# EAGLE design V1 (EAGLE 9.6.2)
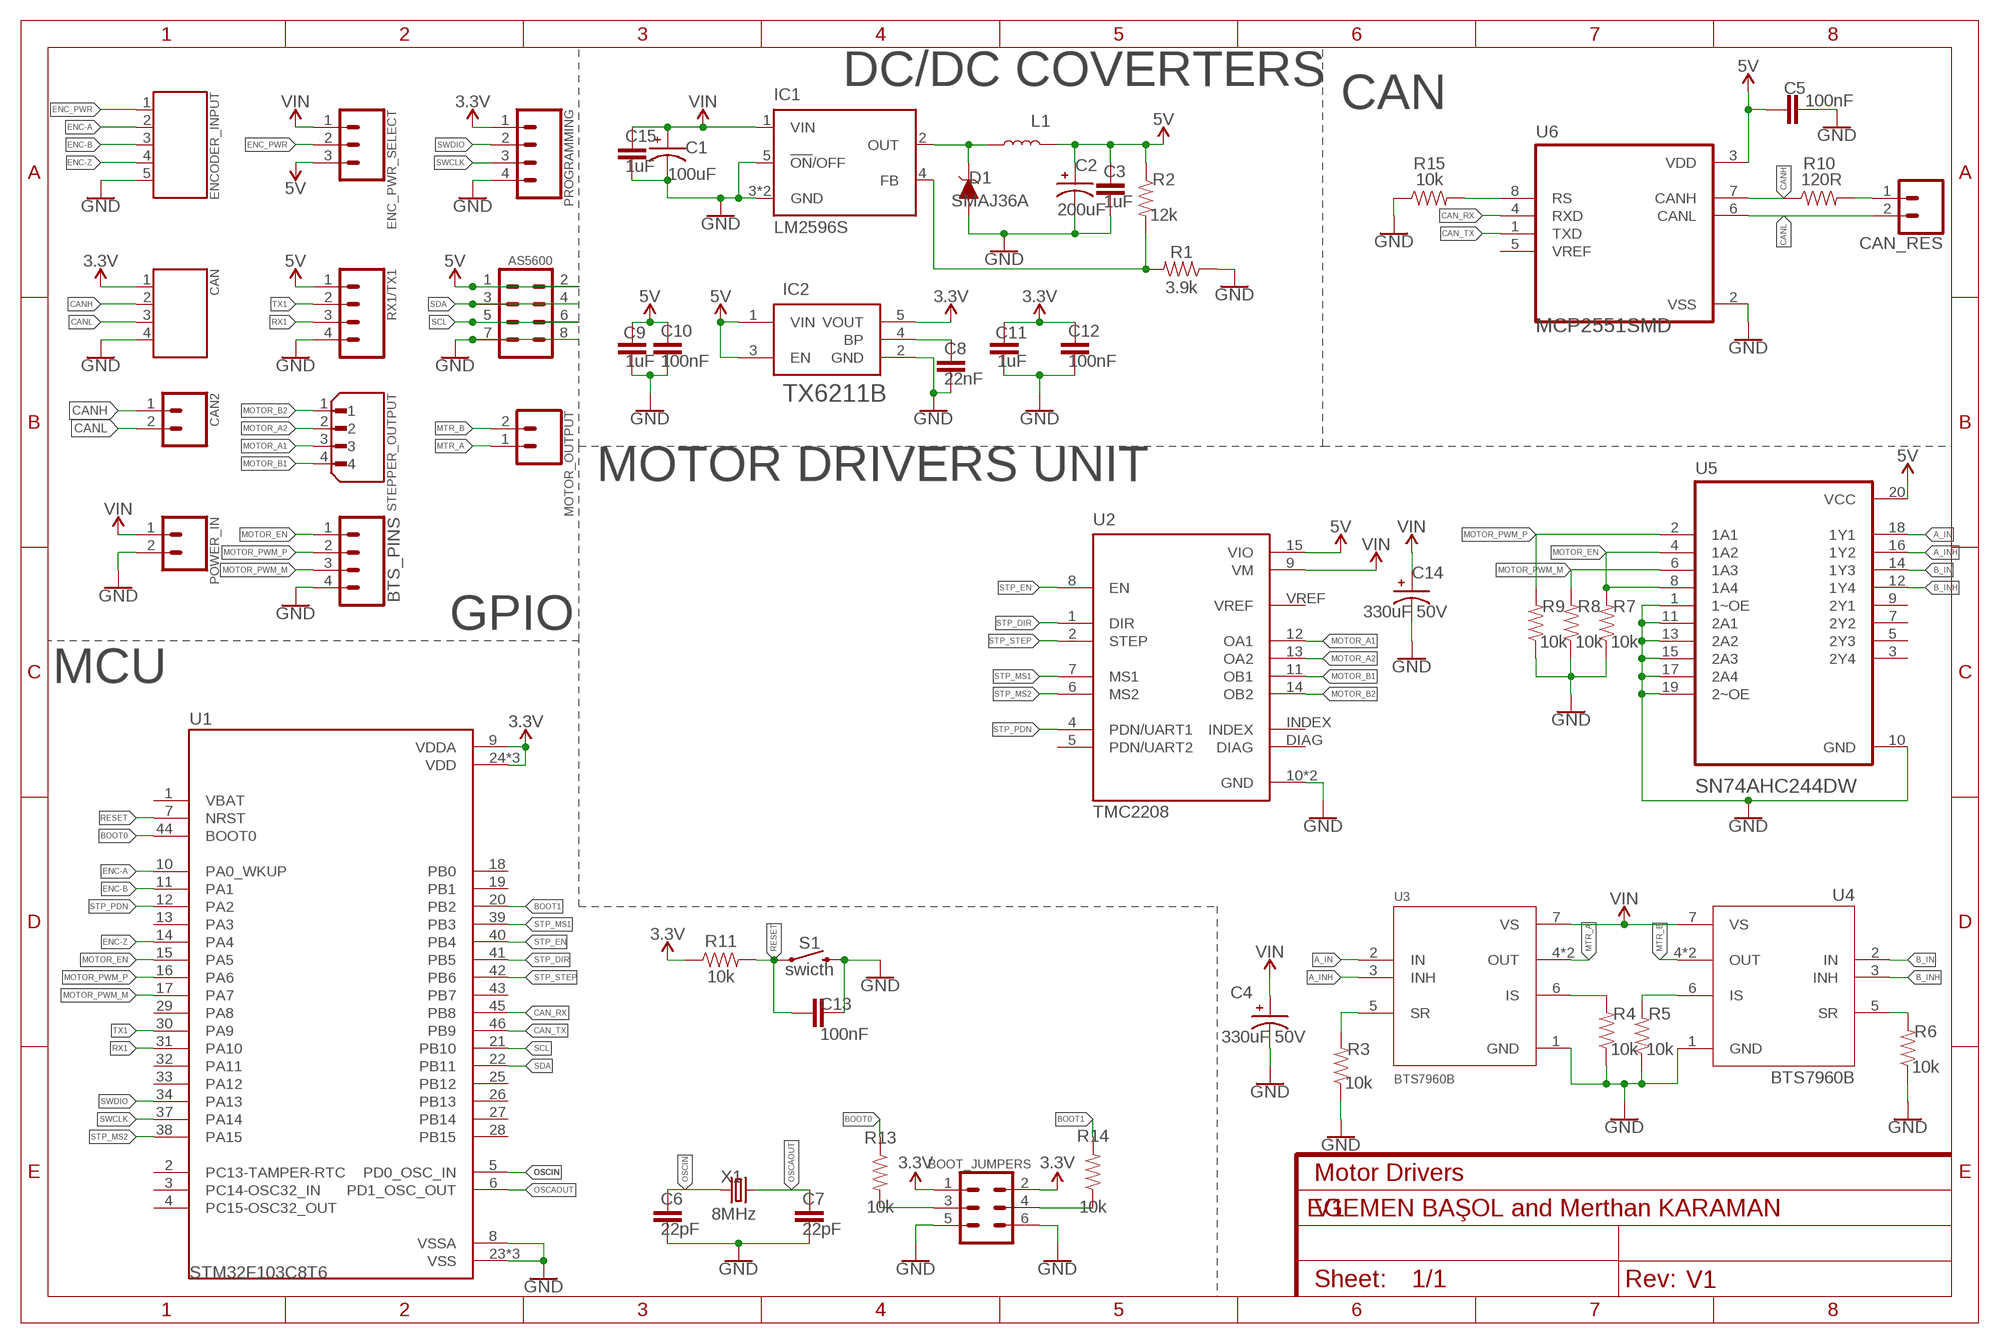
[diagram p0: schematic, sheet 1]
FRAME1 (FRAME-A4L): CNAME: Motor Drivers; CREVISION: V1; DESIGNER: EGEMEN BAŞOL and Merthan KARAMAN; REV: V1

## Parts
AS5600  5V/SDA/SCL/GND  CONN_04X2  [2X4]
BOOT_JUMPERS  CONN_03X2FEMALE  [2X3]
BTS_PINS  GND/ PWM_M/ PWM_P/ EN  CONN_04  [1X04]
C1  100uF  CPOL-SMD  [CPOL-SMD]
C2  200uF  CPOL-SMD  [CPOL-SMD]
C3  1uF  0.18UF-0603-10V-10%  [0603]
C4  330uF 50V  CPOL-RADIAL-5MM-10MM  [CPOL-RADIAL-5MM-10MM]
C5  100nF  CAP-0805  [0805]
C6  22pF  2.2UF-0805-25V-(+80/-20%)  [0805]
C7  22pF  2.2UF-0805-25V-(+80/-20%)  [0805]
C8  22nF  2.2UF-0805-25V-(+80/-20%)  [0805]
C9  1uF  CAP-0805  [0805]
C10  100nF  2.2UF-0805-25V-(+80/-20%)  [0805]
C11  1uF  CAP-0805  [0805]
C12  100nF  2.2UF-0805-25V-(+80/-20%)  [0805]
C13  100nF  2.2UF-0805-25V-(+80/-20%)  [0805]
C14  330uF 50V  CPOL-RADIAL-5MM-10MM  [CPOL-RADIAL-5MM-10MM]
C15  1uF  2.2UF-0805-25V-(+80/-20%)  [0805]
CAN  3.3V/CANH/CANL/GND  5.08MM_4PIN  [5.08MM_4PIN]
CAN2  CANH/CANL  5.08MM_2PIN  [5.08MM_2PIN]
CAN_RES  CONN_02  [1X02]
D1  SMAJ36A  DIODE_TVS_UNI  [DO-214AC]
ENC_PWR_SELECT  VIN/PWR/5V  CONN_03  [1X03]
ENCODER_INPUT  PWR/A/B/Z/GND  5.08MM_5PIN  [5.08MM_5PIN]
IC1  LM2596S  [TO263-5]
IC2  TX6211B  [SOT23-5]
L1  47uH  COIL  [COIL_14X14]
MOTOR_OUTPUT  5.08MM_2PIN  [5.08MM_2PIN]
POWER_IN  VIN/GND  5.08MM_2PIN  [5.08MM_2PIN]
PROGRAMMING  3.3V/SWDIO/SWCLK/GND  CONN_04  [1X04]
R1  3.9k  RESISTOR0805  [0805]
R2  12k  RESISTOR0805  [0805]
R3  10k  RESISTOR0805  [0805]
R4  10k  RESISTOR0805  [0805]
R5  10k  RESISTOR0805  [0805]
R6  10k  RESISTOR0805  [0805]
R7  10k  RESISTOR0805  [0805]
R8  10k  RESISTOR0805  [0805]
R9  10k  RESISTOR0805  [0805]
R10  120R  RESISTOR0805  [0805]
R11  10k  RESISTOR0805  [0805]
R13  10k  RESISTOR0805  [0805]
R14  10k  RESISTOR0805  [0805]
R15  10k  RESISTOR0805  [0805]
RX1/TX1  5V/TX1/RX1/GND  CONN_04  [1X04]
S1  swicth  MOMENTARY-SWITCH-SPST-SMD-5.2MM-TALL  [TACTILE_SWITCH_SMD_5.2MM]
STEPPER_OUTPUT  4PIN_TUNIC_2.5MM  [JST_B4B-XH-A(LF)(SN)]
U1  STM32F103C8T6  [LQFP-48]
U2  TMC2208  TMC2208_SILENTSTEPSTICK  [MODULE_TMC2208_SILENTSTEPSTICK]
U3  BTS7960B  [DPAK127P1490X440-8N]
U4  BTS7960B  [DPAK127P1490X440-8N]
U5  SN74AHC244DW  [SOIC127P1030X265-20N]
U6  MCP2551SMD  [SOIC-8]
X1  8MHz  CRYSTALS-NOGND-HC49  [HC49]

## Nets
3.3V: BOOT_JUMPERS.1 BOOT_JUMPERS.2 C11.2 C12.2 CAN.1 IC2.5(VOUT) PROGRAMMING.1 R11.1 U1.9(VDDA) U1.24(VDD) U1.36(VDD) U1.48(VDD)
5V: AS5600.1 AS5600.2 C2.1 C3.2 C5.2 C9.2 C10.2 ENC_PWR_SELECT.3 IC2.1(VIN) IC2.3(EN) L1.P$2 R2.1 RX1/TX1.1 U2.15(VIO) U5.20(VCC) U6.3(VDD)
A_IN: U3.2(IN) U5.18(1Y1)
A_INH: U3.3(INH) U5.16(1Y2)
B_IN: U4.2(IN) U5.14(1Y3)
B_INH: U4.3(INH) U5.12(1Y4)
BOOT0: R13.1 U1.44(BOOT0)
BOOT1: R14.2 U1.20(PB2)
CAN_RX: U1.45(PB8) U6.4(RXD)
CAN_TX: U1.46(PB9) U6.1(TXD)
CANH: CAN2.1 CAN.2 R10.1 U6.7(CANH)
CANL: CAN2.2 CAN.3 CAN_RES.2 U6.6(CANL)
ENC-A: ENCODER_INPUT.2 U1.10(PA0_WKUP)
ENC-B: ENCODER_INPUT.3 U1.11(PA1)
ENC-Z: ENCODER_INPUT.4 U1.14(PA4)
ENC_PWR: ENC_PWR_SELECT.2 ENCODER_INPUT.1
GND: AS5600.7 AS5600.8 BOOT_JUMPERS.5 BOOT_JUMPERS.6 BTS_PINS.4 C1.2 C2.2 C3.1 C4.N C5.1 C6.1 C7.1 C8.1 C9.1 C10.1 C11.1 C12.1 C13.1 C14.N C15.1 CAN.4 D1.A ENCODER_INPUT.5 IC1.3(GND) IC1.5(!ON!/OFF) IC1.TAB(GND) IC2.2(GND) POWER_IN.2 PROGRAMMING.4 R1.1 R3.1 R4.1 R5.1 R6.1 R7.1 R8.1 R9.1 R15.1 RX1/TX1.4 S1.3 U1.8(VSSA) U1.23(VSS) U1.35(VSS) U1.47(VSS) U2.10(GND) U2.16(GND) U3.1(GND) U4.1(GND) U5.1(1~OE) U5.10(GND) U5.11(2A1) U5.13(2A2) U5.15(2A3) U5.17(2A4) U5.19(2~OE) U6.2(VSS)
MOTOR_A1: STEPPER_OUTPUT.3 U2.12(OA1)
MOTOR_A2: STEPPER_OUTPUT.2 U2.13(OA2)
MOTOR_B1: STEPPER_OUTPUT.4 U2.11(OB1)
MOTOR_B2: STEPPER_OUTPUT.1 U2.14(OB2)
MOTOR_EN: BTS_PINS.1 R7.2 U1.15(PA5) U5.4(1A2) U5.8(1A4)
MOTOR_PWM_M: BTS_PINS.3 R8.2 U1.17(PA7) U5.6(1A3)
MOTOR_PWM_P: BTS_PINS.2 R9.2 U1.16(PA6) U5.2(1A1)
MTR_A: MOTOR_OUTPUT.1 U3.4(OUT) U3.8(OUT)
MTR_B: MOTOR_OUTPUT.2 U4.4(OUT) U4.8(OUT)
N$1: D1.C IC1.2(OUT) L1.P$1
N$2: IC1.4(FB) R1.2 R2.2
N$5: CAN_RES.1 R10.2
N$6: R6.2 U4.5(SR)
N$7: R5.2 U4.6(IS)
N$8: R4.2 U3.6(IS)
N$9: R3.2 U3.5(SR)
N$10: C8.2 IC2.4(BP)
N$12: BOOT_JUMPERS.4 R14.1
N$13: R15.2 U6.8(RS)
N$14: BOOT_JUMPERS.3 R13.2
OSCAOUT: C7.2 U1.6(PD1_OSC_OUT) X1.2
OSCIN: C6.2 U1.5(PD0_OSC_IN) X1.1
RESET: C13.2 R11.2 S1.1 U1.7(NRST)
RX1: RX1/TX1.3 U1.31(PA10)
SCL: AS5600.5 AS5600.6 U1.21(PB10)
SDA: AS5600.3 AS5600.4 U1.22(PB11)
STP_DIR: U1.41(PB5) U2.1(DIR)
STP_EN: U1.40(PB4) U2.8(EN)
STP_MS1: U1.39(PB3) U2.7(MS1)
STP_MS2: U1.38(PA15) U2.6(MS2)
STP_PDN: U1.12(PA2) U2.4(PDN/UART1)
STP_STEP: U1.42(PB6) U2.2(STEP)
SWCLK: PROGRAMMING.3 U1.37(PA14)
SWDIO: PROGRAMMING.2 U1.34(PA13)
TX1: RX1/TX1.2 U1.30(PA9)
VIN: C1.1 C4.P C14.P C15.2 ENC_PWR_SELECT.1 IC1.1(VIN) POWER_IN.1 U2.9(VM) U3.7(VS) U4.7(VS)
Unconnected: U1.1(VBAT) U1.2(PC13-TAMPER-RTC) U1.3(PC14-OSC32_IN) U1.4(PC15-OSC32_OUT) U1.13(PA3) U1.18(PB0) U1.19(PB1) U1.25(PB12) U1.26(PB13) U1.27(PB14) U1.28(PB15) U1.29(PA8) U1.32(PA11) U1.33(PA12) U1.43(PB7) U2.5(PDN/UART2) U2.DIAG U2.INDEX U2.VREF U5.3(2Y4) U5.5(2Y3) U5.7(2Y2) U5.9(2Y1) U6.5(VREF)

## Notes on the sheet
- DC/DC COVERTERS
- CAN
- MOTOR DRIVERS UNIT
- GPIO
- MCU

## Library data of the parts
AS5600 = SparkFun-Connectors:CONN_04X2: Multi connection point. Often used as Generic Header-pin footprint for 0.1 inch spaced/style header connections On any of the 0.1 inch spaced packages, you can populate with these: Break Away Headers - Straight <https://www.sparkfun.com/products/116> (PRT-00116) Break Away Male Headers - Right Angle <https://www.sparkfun.com/products/553> (PRT-00553) Female Headers <https://www.sparkfun.com/products/115> (PRT-00115) Break Away Headers - Machine Pin <https://www.sparkfun.com/products/117> (PRT-00117) Break Away Female Headers - Swiss Machine Pin <https://www.sparkfun.com/products/743> (PRT-00743)
BOOT_JUMPERS = SparkFun-Connectors:CONN_03X2: Multi connection point. Often used as Generic Header-pin footprint for 0.1 inch spaced/style header connections You can populate with any combo of single row headers, but if you'd like an exact match, check these: Header - 2x3 (Male, 0.1") <https://www.sparkfun.com/products/12807> (PRT-12807) Header - 2x3 (Female, 0.1") <https://www.sparkfun.com/products/13010> (PRT-13010) 2x3 Pin Shrouded Header <https://www.sparkfun.com/products/10877> (PRT-10877) On any of the 0.1 inch spaced packages, you can populate with these: Break Away Headers - Straight <https://www.sparkfun.com/products/116> (PRT-00116) Break Away Male Headers - Right Angle <https://www.sparkfun.com/products/553> (PRT-00553) Female Headers <https://www.sparkfun.com/products/115> (PRT-00115) Break Away Headers - Machine Pin <https://www.sparkfun.com/products/117> (PRT-00117) Break Away Female Headers - Swiss Machine Pin <https://www.sparkfun.com/products/743> (PRT-00743) Special note: the shrouded connector mates well with our 3x2 ribbon cables: Ribbon Crimp Connector - 6-pin (2x3, Female) <https://www.sparkfun.com/products/10651> (PRT-10651) Ribbon Cable - 6 wire (15ft) <https://www.sparkfun.com/products/10646> (PRT-10646); PROD_ID: CONN-11566; VALUE: FEMALE 2x3
BTS_PINS PROGRAMMING RX1/TX1 = SparkFun-Connectors:CONN_04: Multi connection point. Often used as Generic Header-pin footprint for 0.1 inch spaced/style header connections On any of the 0.1 inch spaced packages, you can populate with these: Break Away Headers - Straight <https://www.sparkfun.com/products/116> (PRT-00116) Break Away Male Headers - Right Angle <https://www.sparkfun.com/products/553> (PRT-00553) Female Headers <https://www.sparkfun.com/products/115> (PRT-00115) Break Away Headers - Machine Pin <https://www.sparkfun.com/products/117> (PRT-00117) Break Away Female Headers - Swiss Machine Pin <https://www.sparkfun.com/products/743> (PRT-00743) For SCREWTERMINALS and SPRING TERMINALS visit here: Screw Terimnals on SparkFun.com <https://www.sparkfun.com/search/results?term=Screw+Terminals> (5mm/3.5mm/2.54mm spacing) This device is also useful as a general connection point to wire up your design to another part of your project. Our various solder wires solder well into these plated through hole pads. Hook-Up Wire - Assortment (Stranded, 22 AWG) <https://www.sparkfun.com/products/11375> (PRT-11375) Hook-Up Wire - Assortment (Solid Core, 22 AWG) <https://www.sparkfun.com/products/11367> (PRT-11367) View the entire wire category on our website here <https://www.sparkfun.com/categories/141> Special notes: Molex polarized connector foot print use with SKU : PRT-08231 with associated crimp pins and housings. 1MM SMD Version SKU: PRT-10208; PROD_ID: CONN-09696
C1 C2 = El_yapimi:CPOL-SMD: Check availability <https://pricing.snapeda.com/parts/EEEFN1H101L/Panasonic/view-part?ref=eda>; AVAILABILITY: In Stock; DESCRIPTION: CAP ALUM 100UF 20% 50V SMD; MF: Panasonic; MP: EEEFN1H101L; PACKAGE: RADIAL-2 Panasonic; PRICE: None; PURCHASE-URL: https://pricing.snapeda.com/search/part/EEEFN1H101L/?ref=eda
C3 = SparkFun-Capacitors:0.18UF: 0.18µF ceramic capacitor A capacitor is a passive two-terminal electrical component used to store electrical energy temporarily in an electric field.; PROD_ID: CAP-12380; VALUE: 0.18uF
C4 C14 = El_yapimi:CPOL-RADIAL-5MM-10MM: M-A Check availability <https://pricing.snapeda.com/parts/ECA2VM4R7/Panasonic/view-part?ref=eda>; AVAILABILITY: In Stock; DESCRIPTION: Aluminium Electrolytic Capacitor, Aec-Q200 M Series, 4.7 - F, - 20%, 350 V, 10 Mm; MF: Panasonic; MP: ECA2VM4R7; PACKAGE: RADIAL-2 Panasonic; PRICE: None; PURCHASE-URL: https://pricing.snapeda.com/search/part/ECA2VM4R7/?ref=eda
C5 C9 C11 = SparkFun-Capacitors:CAP
C6-C8 C10 C12 C13 C15 = SparkFun-Capacitors:2.2UF: 2.2µF ceramic capacitors A capacitor is a passive two-terminal electrical component used to store electrical energy temporarily in an electric field.; PROD_ID: CAP-11624; VALUE: 2.2uF
CAN = El_yapimi:5.08MM_4PIN: Check availability <https://pricing.snapeda.com/parts/TB006-508-04BE/CUI%20Devices/view-part?ref=eda>; AVAILABILITY: In Stock; CUI_PURCHASE_URL: https://www.cuidevices.com/product/interconnect/connectors/terminal-blocks/tb006-508-series?utm_source=snapeda.com&utm_medium=referral&utm_campaign=snapedaBOM; DESCRIPTION: 2~24 Poles, Screw Type, Horizontal, 5.08 Pitch, 26~14 (AWG), Terminal Block Connector; MF: CUI Devices; MP: TB006-508-04BE; PACKAGE: None; PRICE: None; PURCHASE-URL: https://pricing.snapeda.com/search/part/TB006-508-04BE/?ref=eda
CAN2 MOTOR_OUTPUT POWER_IN = El_yapimi:5.08MM_2PIN
CAN_RES = SparkFun-Connectors:CONN_02: Multi connection point. Often used as Generic Header-pin footprint for 0.1 inch spaced/style header connections On any of the 0.1 inch spaced packages, you can populate with these: Break Away Headers - Straight <https://www.sparkfun.com/products/116> (PRT-00116) Break Away Male Headers - Right Angle <https://www.sparkfun.com/products/553> (PRT-00553) Female Headers <https://www.sparkfun.com/products/115> (PRT-00115) Break Away Headers - Machine Pin <https://www.sparkfun.com/products/117> (PRT-00117) Break Away Female Headers - Swiss Machine Pin <https://www.sparkfun.com/products/743> (PRT-00743) For SCREWTERMINALS and SPRING TERMINALS visit here: Screw Terimnals on SparkFun.com <https://www.sparkfun.com/search/results?term=Screw+Terminals> (5mm/3.5mm/2.54mm spacing) This device is also useful as a general connection point to wire up your design to another part of your project. Our various solder wires solder well into these plated through hole pads. Hook-Up Wire - Assortment (Stranded, 22 AWG) <https://www.sparkfun.com/products/11375> (PRT-11375) Hook-Up Wire - Assortment (Solid Core, 22 AWG) <https://www.sparkfun.com/products/11367> (PRT-11367) View the entire wire category on our website here <https://www.sparkfun.com/categories/141> Special notes: Molex polarized connector foot print use with: PRT-08233 with associated crimp pins and housings. 2.54_SCREWTERM for use with PRT-10571. 3.5mm Screw Terminal footprints for PRT-08084 5mm Screw Terminal footprints for use with PRT-08432
D1 = SparkFun-DiscreteSemi:DIODE_TVS_UNI; PROD_ID: DIO-15812
ENC_PWR_SELECT = SparkFun-Connectors:CONN_03: Multi connection point. Often used as Generic Header-pin footprint for 0.1 inch spaced/style header connections On any of the 0.1 inch spaced packages, you can populate with these: Break Away Headers - Straight <https://www.sparkfun.com/products/116> (PRT-00116) Break Away Male Headers - Right Angle <https://www.sparkfun.com/products/553> (PRT-00553) Female Headers <https://www.sparkfun.com/products/115> (PRT-00115) Break Away Headers - Machine Pin <https://www.sparkfun.com/products/117> (PRT-00117) Break Away Female Headers - Swiss Machine Pin <https://www.sparkfun.com/products/743> (PRT-00743) Stackable Header - 3 Pin (Female, 0.1") <https://www.sparkfun.com/products/13875> (PRT-13875) For SCREWTERMINALS and SPRING TERMINALS visit here: Screw Terimnals on SparkFun.com <https://www.sparkfun.com/search/results?term=Screw+Terminals> (5mm/3.5mm/2.54mm spacing) This device is also useful as a general connection point to wire up your design to another part of your project. Our various solder wires solder well into these plated through hole pads. Hook-Up Wire - Assortment (Stranded, 22 AWG) <https://www.sparkfun.com/products/11375> (PRT-11375) Hook-Up Wire - Assortment (Solid Core, 22 AWG) <https://www.sparkfun.com/products/11367> (PRT-11367) View the entire wire category on our website here <https://www.sparkfun.com/categories/141> Special notes: Molex polarized connector foot print use with SKU : PRT-08232 with associated crimp pins and housings.
ENCODER_INPUT = El_yapimi:5.08MM_5PIN: Check availability <https://pricing.snapeda.com/parts/TB006-508-05BE/CUI%20Devices/view-part?ref=eda>; AVAILABILITY: In Stock; CUI_PURCHASE_URL: https://www.cuidevices.com/product/interconnect/connectors/terminal-blocks/tb006-508-series?utm_source=snapeda.com&utm_medium=referral&utm_campaign=snapedaBOM; DESCRIPTION: 2~24 Poles, Screw Type, Horizontal, 5.08 Pitch, 26~14 (AWG), Terminal Block Connector; MF: CUI Devices; MP: TB006-508-05BE; PACKAGE: None; PRICE: None; PURCHASE-URL: https://pricing.snapeda.com/search/part/TB006-508-05BE/?ref=eda
IC1 = El_yapimi:LM2596S
IC2 = El_yapimi:TX6211B
L1 = El_yapimi:COIL
R1-R11 R13-R15 = SparkFun-Resistors:RESISTOR: Generic Resistor Package
S1 = SparkFun-Switches:MOMENTARY-SWITCH-SPST: Momentary Switch (Pushbutton) - SPST Normally-open (NO) SPST momentary switches (buttons, pushbuttons). Variants PTH-12MM - 12mm square, through-hole Momentary Pushbutton Switch - 12mm Square <https://www.sparkfun.com/products/9190> (COM-09190) PTH-6.0MM, PTH-6.0MM-KIT - 6.0mm square, through-hole Mini Pushbutton Switch <https://www.sparkfun.com/products/97> (COM-00097) KIT package intended for soldering kit's - only one side of pads' copper is exposed. PTH-RIGHT-ANGLE-KIT - Right-angle, through-hole Right Angle Tactile Button <https://www.sparkfun.com/products/10791> - Used on SparkFun BigTime Watch Kit <https://www.sparkfun.com/products/11734> SMD-12MM - 12mm square, surface-mount Tactile Button - SMD (12mm) <https://www.sparkfun.com/products/12993> (COM-12993) Used on SparkFun PicoBoard <https://www.sparkfun.com/products/11888> SMD-4.5MM - 4.5mm Square Trackball Switch Used on SparkFun Blackberry Trackballer Breakout <https://www.sparkfun.com/products/13169> SMD-4.6MMX2.8MM - 4.60mm x 2.80mm, surface mount Used on SparkFun Pro Micro - RP2040 <https://www.sparkfun.com/products/17717> SMD-5.2MM, SMD-5.2-REDUNDANT - 5.2mm square, surface-mount Mini Pushbutton Switch - SMD <https://www.sparkfun.com/products/8720> (COM-08720) Used on Arduino Pro Mini <https://www.sparkfun.com/products/11114> REDUNDANT package connects both switch circuits together SMD-6.0X3.5MM - 6.0 x 3.5mm, surface mount Momentary Reset Switch SMD <https://www.sparkfun.com/products/8229> (COM-08229) SMD-6.2MM-TALL - 6.2mm square, surface mount Tactile Button - SMD (6mm) <https://www.sparkfun.com/products/12992> Used on SparkFun Digital Sandbox <https://www.sparkfun.com/products/12651> SMD-RIGHT-ANGLE - Right-angle, surface mount Used on SparkFun Block for Intel® Edison - Arduino <https://www.sparkfun.com/products/13036>; PROD_ID: SWCH-14139
STEPPER_OUTPUT = El_yapimi:4PIN_TUNIC_2.5MM: Check availability <https://pricing.snapeda.com/parts/B4B-XH-A%28LF%29%28SN%29/JST%20Sales/view-part?ref=eda>; AVAILABILITY: In Stock; DESCRIPTION: Connector Header Through Hole 4 position 0.098 (2.50mm); MF: JST Sales; MP: B4B-XH-A(LF)(SN); PACKAGE: None; PRICE: None; PURCHASE-URL: https://pricing.snapeda.com/search/part/B4B-XH-A(LF)(SN)/?ref=eda
U1 = El_yapimi:STM32F103C8T6: Mainstream Performance line, ARM Cortex-M3 MCU with 64 Kbytes Flash, 72 MHz CPU, motor control, USB and CAN Check availability <https://pricing.snapeda.com/parts/STM32F103C8T6/STMicroelectronics/view-part?ref=eda>; AVAILABILITY: In Stock; DESCRIPTION: ARM® Cortex®-M3 STM32F1 Microcontroller IC 32-Bit 72MHz 64KB (64K x 8) FLASH 48-LQFP (7x7); MF: STMicroelectronics; MP: STM32F103C8T6; PACKAGE: LQFP-48 STMicroelectronics; PRICE: None; PURCHASE-URL: https://pricing.snapeda.com/search/part/STM32F103C8T6/?ref=eda
U2 = El_yapimi:TMC2208_SILENTSTEPSTICK: TMC2208 Motor Controller/Driver, Stepper Power Management Evaluation Board Check availability <https://pricing.snapeda.com/parts/TMC2208%20SILENTSTEPSTICK/Trinamic%20Motion/view-part?ref=eda>; AVAILABILITY: In Stock; DESCRIPTION: TMC2208 Motor Controller/Driver, Stepper Power Management Evaluation Board; MF: Trinamic Motion; MP: TMC2208 SILENTSTEPSTICK; PACKAGE: None; PRICE: None; PURCHASE-URL: https://pricing.snapeda.com/search/part/TMC2208 SILENTSTEPSTICK/?ref=eda
U3 U4 = El_yapimi:BTS7960B: Half Bridge Motor Driver 7-Pin(6+Tab) TO-263 Check availability <https://pricing.snapeda.com/parts/BTS7960B/Infineon/view-part?ref=eda>
U5 = El_yapimi:SN74AHC244DW: Check availability <https://pricing.snapeda.com/parts/SN74AHC244DW/Texas%20Instruments/view-part?ref=eda>; AVAILABILITY: In Stock; DESCRIPTION: 8-ch, 2-V to 5.5-V buffers with 3-state outputs; MF: Texas Instruments; MP: SN74AHC244DW; PACKAGE: SOIC-20 Texas Instruments; PRICE: None; PURCHASE-URL: https://pricing.snapeda.com/search/part/SN74AHC244DW/?ref=eda
U6 = El_yapimi:MCP2551: Check availability <https://pricing.snapeda.com/parts/MCP2551-E/P/Microchip/view-part?ref=eda>
X1 = IQD-Frequency-Products:CRYSTALS-NOGND: CRYSTALS CAN NOT GROUNDED

## Board
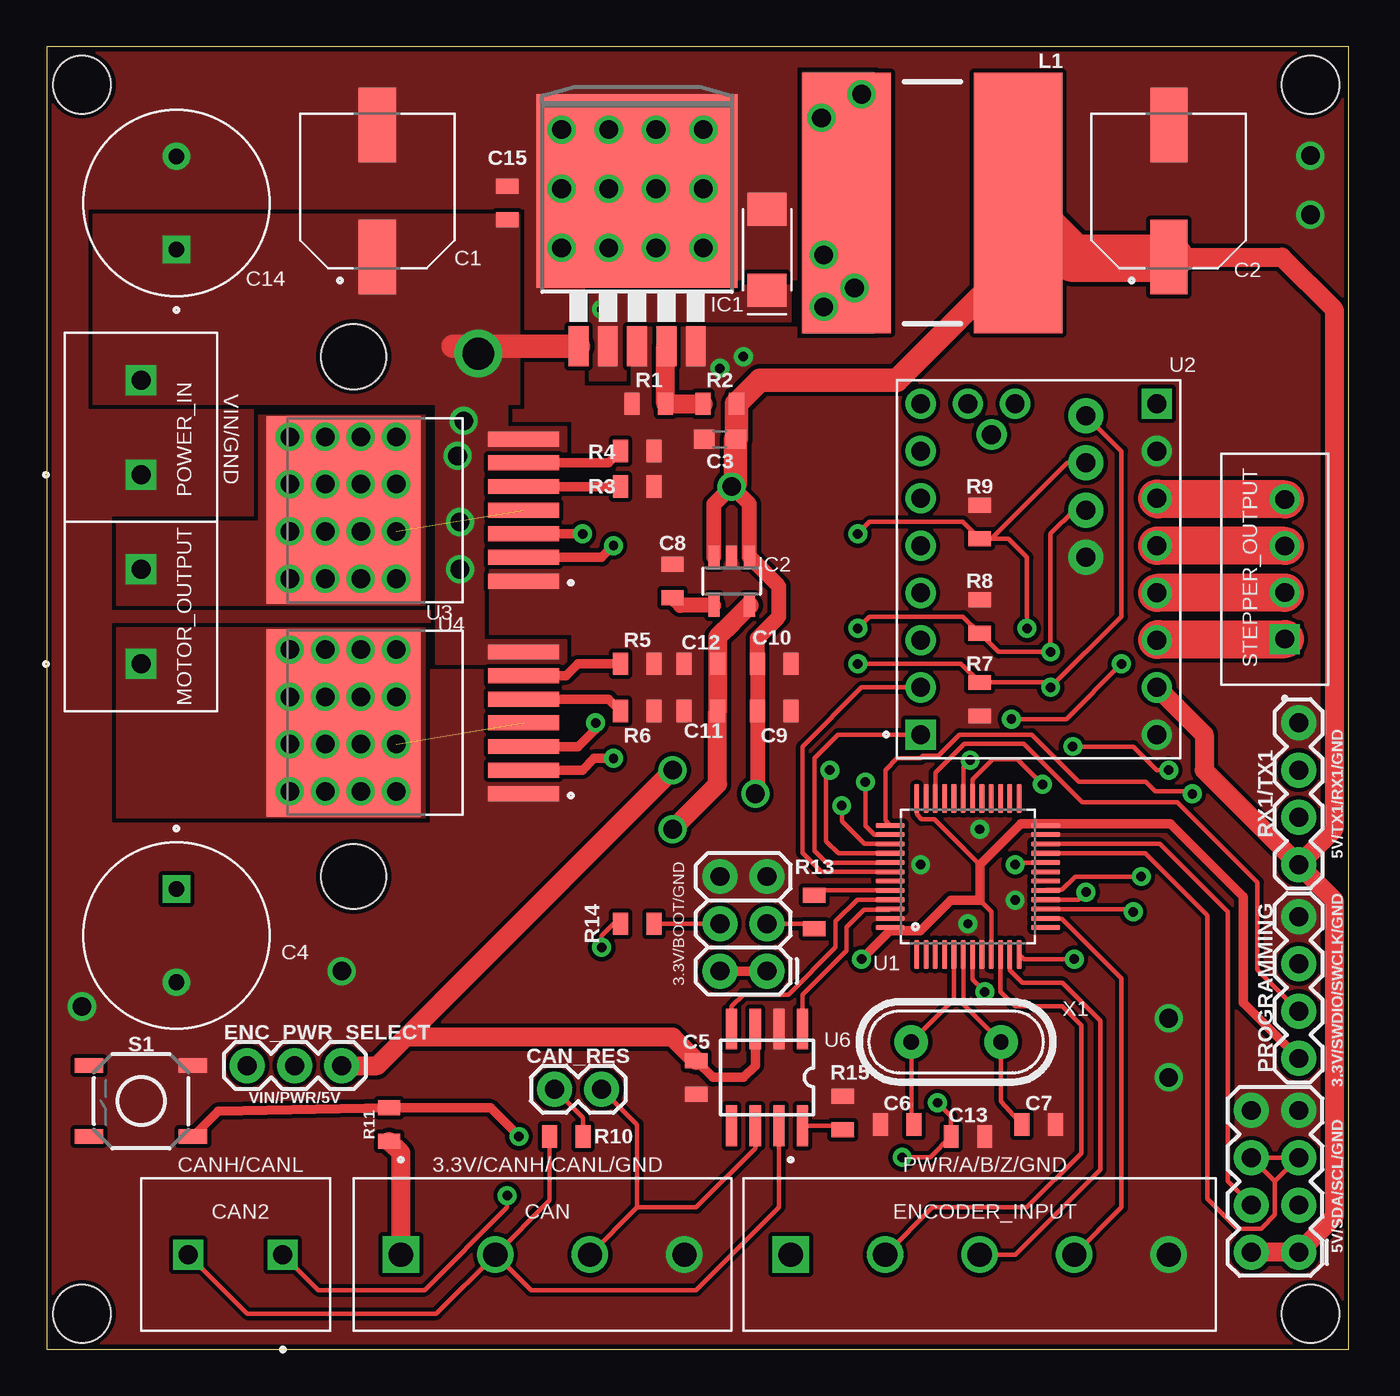
[diagram p1: board, top side]
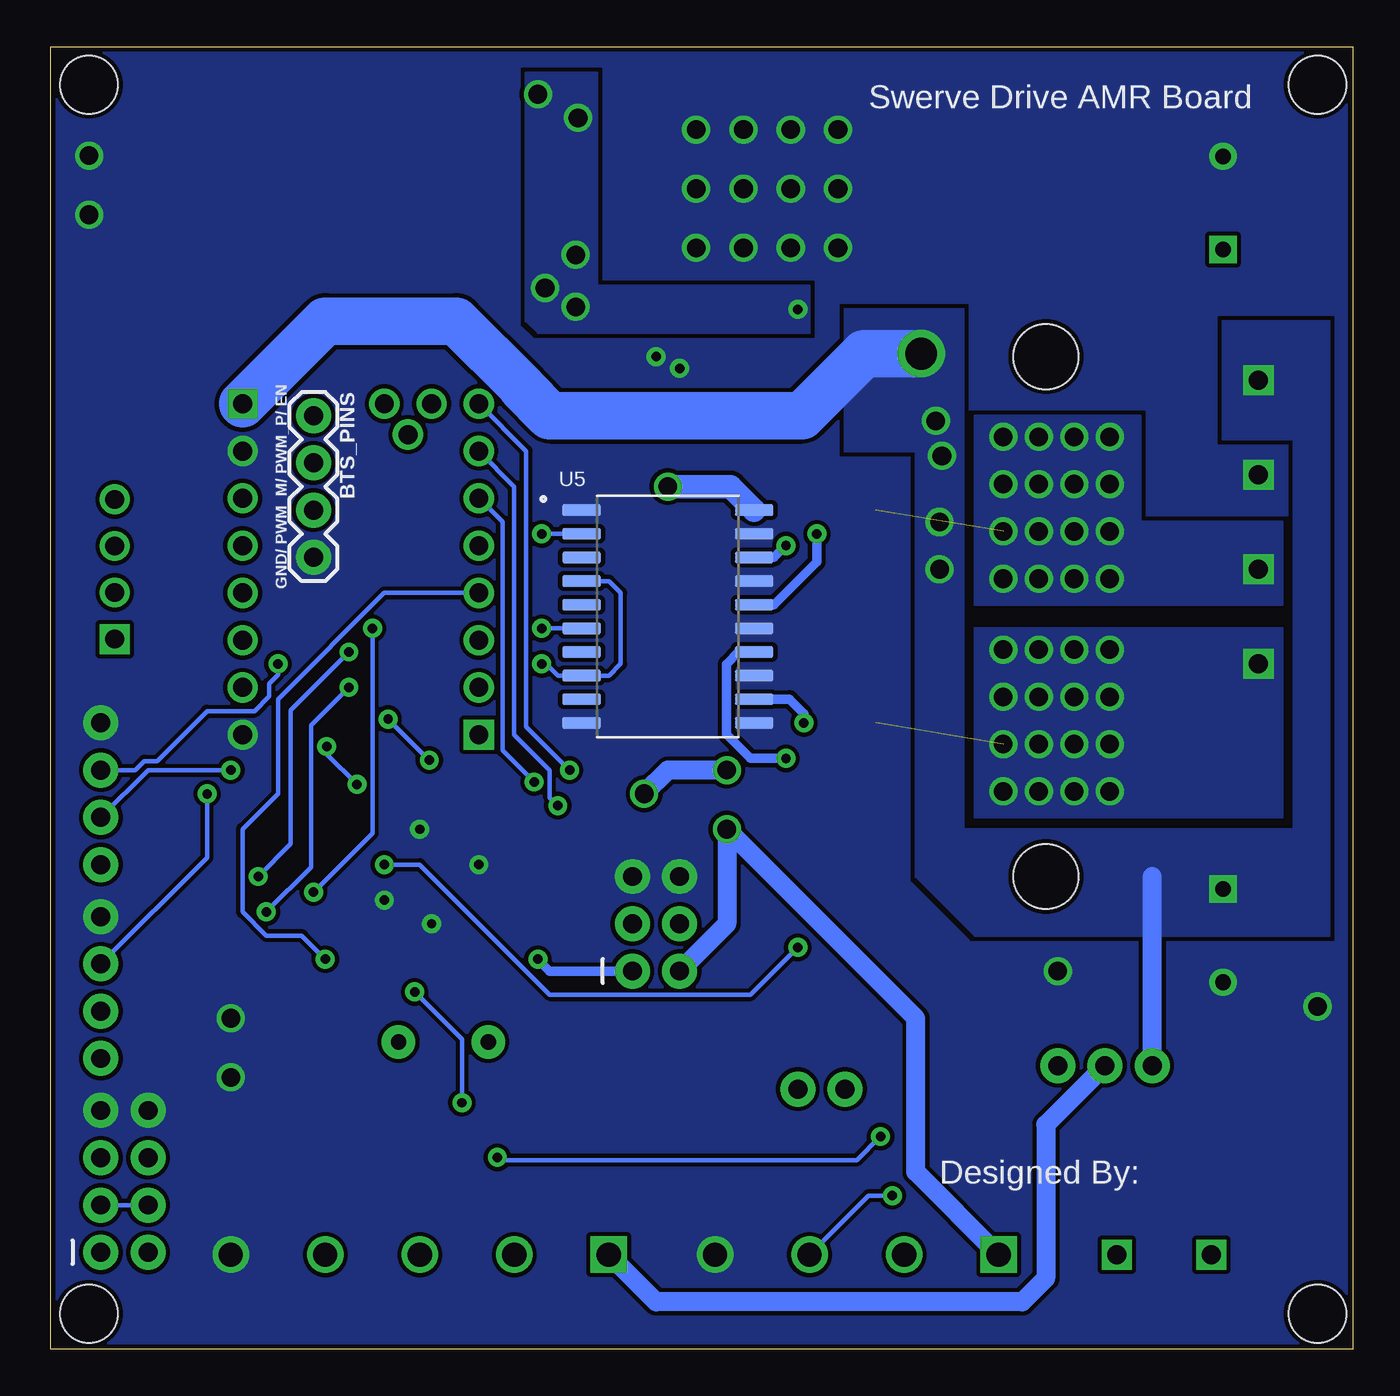
[diagram p2: board, bottom side, seen from below]

Size 70 x 70 mm. Coordinates in mm from the lower left corner, seen from the top.
Outline: 0,70 0,0 70,0 70,70 0,70
Copper layers (1*16): Top 0.035mm / dielectric 1.5mm / Bottom 0.035mm
Design rules "SparkFun *": minimum track width 8mil, minimum drill 20mil, track to track 9mil, track to pad 8mil, pad to pad 8mil, via to via 8mil, smd to smd 8mil, copper to edge 10mil, drill to drill 8mil, minimum pad ring 12mil, minimum via ring 10mil, stop-mask expansion 4mil, vias tented up to drill 25mil, thermal gap 10mil
Holes 3.1 mm at 1.91,67.94 1.91,1.91 67.94,67.94 67.94,1.91
Holes 3.5 mm at 16.51,53.34 16.51,25.4

### Footprints (pad centres in the part's own frame; a part is rotated, then mirrored left to right if it is on the bottom)
2X4 = drill 1.016 pad 1.88: 1 -3.81,-1.27; 2 -3.81,1.27; 3 -1.27,-1.27; 4 -1.27,1.27; 5 1.27,-1.27; 6 1.27,1.27; 7 3.81,-1.27; 8 3.81,1.27
2X3 = drill 1.016 pad 1.88: 1 0,0; 2 0,2.54; 3 2.54,0; 4 2.54,2.54; 5 5.08,0; 6 5.08,2.54
1X04 = drill 1.016 pad 1.88: 1 0,0; 2 2.54,0; 3 5.08,0; 4 7.62,0
CPOL-SMD = smd 4 x 2: 1 -3.55,0; 2 3.55,0
0603 = smd 1.1 x 1: 1 -0.85,0; 2 0.85,0
CPOL-RADIAL-5MM-10MM = drill 0.85 pad 1.2: N 2.5,0 | drill 0.85 pad 1.2 square: P -2.5,0
0805 = smd 0.8 x 1.2: 1 -0.9,0; 2 0.9,0
5.08MM_4PIN = drill 1.3 square: 1 0,0 | drill 1.3: 2 5.08,0; 3 10.16,0; 4 15.24,0
5.08MM_2PIN = drill 1.016 square: 1 5.08,0; 2 0,0
1X02 = drill 1.016 pad 1.88: 1 0,0; 2 2.54,0
DO-214AC = smd 1.778 x 2.083: A 2.21,0; C -2.159,0
1X03 = drill 1.016 pad 1.88: 1 0,0; 2 2.54,0; 3 5.08,0
5.08MM_5PIN = drill 1.3 square: 1 0,0 | drill 1.3: 2 5.08,0; 3 10.16,0; 4 15.24,0; 5 20.32,0
TO263-5 = smd 1.067 x 2.159: 1 -3.15,-8.331; 2 -1.575,-8.331; 3 0,-8.331; 4 1.575,-8.331; 5 3.15,-8.331 | smd 10.8 x 10.41: TAB 0,0
SOT23-5 = smd 0.6 x 1.2: 1 -0.95,-1.306; 2 0,-1.306; 3 0.95,-1.306; 4 0.95,1.306; 5 -0.95,1.306
COIL_14X14 = smd 14 x 4.75: P$1 0,4.6; P$2 0,-4.6
TACTILE_SWITCH_SMD_5.2MM = smd 1.524 x 0.762: 1 -2.794,1.905; 2 2.794,1.905; 3 -2.794,-1.905; 4 2.794,-1.905
JST_B4B-XH-A(LF)(SN) = drill 1 square: 1 -3.75,-0.525 | drill 1: 2 -1.25,-0.525; 3 1.25,-0.525; 4 3.75,-0.525
LQFP-48 = smd 1.56 x 0.28: 1 -4.18,2.75; 2 -4.18,2.25; 3 -4.18,1.75; 4 -4.18,1.25; 5 -4.18,0.75; 6 -4.18,0.25; 7 -4.18,-0.25; 8 -4.18,-0.75; 9 -4.18,-1.25; 10 -4.18,-1.75; 11 -4.18,-2.25; 12 -4.18,-2.75; 25 4.18,-2.75; 26 4.18,-2.25; 27 4.18,-1.75; 28 4.18,-1.25; 29 4.18,-0.75; 30 4.18,-0.25; 31 4.18,0.25; 32 4.18,0.75; 33 4.18,1.25; 34 4.18,1.75; 35 4.18,2.25; 36 4.18,2.75 | smd 0.28 x 1.56: 13 -2.75,-4.18; 14 -2.25,-4.18; 15 -1.75,-4.18; 16 -1.25,-4.18; 17 -0.75,-4.18; 18 -0.25,-4.18; 19 0.25,-4.18; 20 0.75,-4.18; 21 1.25,-4.18; 22 1.75,-4.18; 23 2.25,-4.18; 24 2.75,-4.18; 37 2.75,4.18; 38 2.25,4.18; 39 1.75,4.18; 40 1.25,4.18; 41 0.75,4.18; 42 0.25,4.18; 43 -0.25,4.18; 44 -0.75,4.18; 45 -1.25,4.18; 46 -1.75,4.18; 47 -2.25,4.18; 48 -2.75,4.18
MODULE_TMC2208_SILENTSTEPSTICK = drill 1.016 square: 1 6.35,8.89; 9 -6.35,-8.89 | drill 1.016: 2 6.35,6.35; 3 6.35,3.81; 4 6.35,1.27; 5 6.35,-1.27; 6 6.35,-3.81; 7 6.35,-6.35; 8 6.35,-8.89; 10 -6.35,-6.35; 11 -6.35,-3.81; 12 -6.35,-1.27; 13 -6.35,1.27; 14 -6.35,3.81; 15 -6.35,6.35; 16 -6.35,8.89; DIAG 3.81,-8.89; INDEX 1.27,-8.89; VREF 2.54,-7.239
DPAK127P1490X440-8N = smd 3.81 x 0.8: 1 -5.95,3.81; 2 -5.95,2.54; 3 -5.95,1.27; 4 -5.95,0; 5 -5.95,-1.27; 6 -5.95,-2.54; 7 -5.95,-3.81 | smd 8.29 x 10.07: 8 3.71,0
SOIC127P1030X265-20N = smd 2.06 x 0.6: 1 -4.64,5.715; 2 -4.64,4.445; 3 -4.64,3.175; 4 -4.64,1.905; 5 -4.64,0.635; 6 -4.64,-0.635; 7 -4.64,-1.905; 8 -4.64,-3.175; 9 -4.64,-4.445; 10 -4.64,-5.715; 11 4.64,-5.715; 12 4.64,-4.445; 13 4.64,-3.175; 14 4.64,-1.905; 15 4.64,-0.635; 16 4.64,0.635; 17 4.64,1.905; 18 4.64,3.175; 19 4.64,4.445; 20 4.64,5.715
SOIC-8 = smd 2.2 x 0.6: 1 -2.6,1.905; 2 -2.6,0.635; 3 -2.6,-0.635; 4 -2.6,-1.905; 5 2.6,-1.905; 6 2.6,-0.635; 7 2.6,0.635; 8 2.6,1.905
HC49 = drill 0.813 pad 1.8: 1 -2.413,0; 2 2.413,0

### Placement (x,y rotation side)
AS5600  66.04,9.02 90 top
BOOT_JUMPERS  38.73,20.32 90 top
BTS_PINS  55.88,50.16 270 bottom
C1  17.78,62.23 90 top
C2  60.33,62.23 90 top
C3  36.2,48.9 0 top
C4  6.99,22.23 270 top
C5  34.92,14.61 90 top
C6  45.72,12.06 0 top
C7  53.34,12.06 180 top
C8  33.66,41.27 270 top
C9  39.12,34.29 180 top
C10  39.12,36.83 180 top
C11  35.18,34.29 0 top
C12  35.18,36.83 0 top
C13  49.53,11.43 180 top
C14  6.99,61.59 90 top
C15  24.77,61.59 270 top
CAN  19.05,5.08 0 top
CAN2  12.7,5.08 180 top
CAN_RES  27.3,13.97 0 top
D1  38.73,59.05 90 top
ENC_PWR_SELECT  10.79,15.24 0 top
ENCODER_INPUT  40.01,5.08 0 top
IC1  31.75,62.23 0 top
IC2  36.83,41.27 180 top
L1  47.62,61.59 90 top
MOTOR_OUTPUT  5.08,36.83 90 top
POWER_IN  5.08,46.99 90 top
PROGRAMMING  67.31,15.62 90 top
R1  32.38,50.8 0 top
R2  36.2,50.8 180 top
R3  31.75,46.35 180 top
R4  31.75,48.26 180 top
R5  31.75,36.83 180 top
R6  31.75,34.29 180 top
R7  50.16,34.92 90 top
R8  50.16,39.37 270 top
R9  50.16,44.45 270 top
R10  27.94,11.43 0 top
R11  18.41,12.06 90 top
R13  41.27,23.5 270 top
R14  31.75,22.86 180 top
R15  42.8,12.7 270 top
RX1/TX1  67.31,26.04 90 top
S1  5.08,13.34 180 top
STEPPER_OUTPUT  66.04,41.91 90 top
U1  49.53,25.4 90 top
U2  53.34,41.91 180 top
U3  19.68,45.09 180 top
U4  19.68,33.66 180 top
U5  36.83,39.37 0 bottom
U6  38.73,14.61 270 top
X1  48.9,16.51 0 top

### Tracks (layer width: path | path; a pad name or v marks a point on that pad's centre or on a via)
3.3V  (via drill 0.51, 1)
  Top 0.254: 45.35,22.49 U1.48 | 50.16,26.04 47.73,28.47 47.04,28.47 46.78,28.73 U1.36 | U1.24 53.44,28.15 53.34,28.25 | U1.9 50.78,23.52 50.16,24.13
  Top 0.508: BOOT_JUMPERS.1 BOOT_JUMPERS.2 | v43.81,20.95 45.35,22.49 46.99,22.49 48.63,24.13 50.16,24.13 50.16,26.04 52.38,28.25 53.34,28.25 60.4,28.25 64.33,24.32 64.33,18.61 PROGRAMMING.1
  Top 1.016: CAN.1 19.05,10.55 R11.1 | IC2.5 36.89,39.08 36.89,39.07 36.08,38.26 C12.2 C11.2 36.08,30.36 v33.66,27.94
  Bottom 0.508: v43.81,20.95 43.18,20.32 BOOT_JUMPERS.1
  Bottom 1.016: BOOT_JUMPERS.2 33.66,22.86 v33.66,27.94 23.5,17.78 23.5,9.53 CAN.1
5V  (via drill 1)
  Top 0.508: U6.3 38.1,15.24 37.47,14.61 35.83,14.61 C5.2
  Top 0.813: IC2.3 35.88,45.41 v36.83,46.35 37.78,45.41 IC2.1 39.37,40.99 39.37,39.37 38.22,38.22 C10.2 C9.2 38.22,29.96 v38.1,29.84
  Top 1.016: C5.2 33.66,16.77 19.42,16.77 19.37,16.83 | v33.66,31.11 19.37,16.83 | 19.37,16.83 17.78,15.24 ENC_PWR_SELECT.3 | U2.15 62.23,33.02 62.23,31.11 RX1/TX1.1 | RX1/TX1.1 69.22,27.94 69.22,55.88 66.42,58.68 C2.1 | RX1/TX1.1 69.22,24.13 69.22,7.11 AS5600.1 AS5600.2
  Top 1.27: L1.P$2 52.23,58.58 45.72,52.07 38.37,52.07 R2.1 37.09,48.95 C3.2 37.05,46.57 v36.83,46.35
  Top 2.54: L1.P$2 55.2,58.62 60.26,58.62 C2.1
  Bottom 1.016: v33.66,31.11 36.83,31.11 v38.1,29.84
  Bottom 1.27: U5.20 33.46,46.35 v36.83,46.35
A_IN  (via drill 0.51)
  Top 0.508: v30.48,43.18 29.84,42.55 U3.2
  Bottom 0.508: U5.18 31.11,42.55 v30.48,43.18
A_INH  (via drill 0.51)
  Top 0.508: v28.82,43.81 U3.3
  Bottom 0.508: U5.16 31.11,40.01 28.82,42.3 v28.82,43.81
B_IN  (via drill 0.51)
  Top 0.508: U4.2 28.81,31.11 29.45,31.75 v30.48,31.75
  Bottom 0.508: U5.14 33.02,37.47 33.68,36.81 33.68,33.04 32.38,31.75 v30.48,31.75
B_INH  (via drill 0.51)
  Top 0.508: v29.52,33.66 29.52,33.33 28.57,32.38 U4.3
  Bottom 0.508: U5.12 30.29,34.92 29.52,34.16 v29.52,33.66
BOOT0
  Top 0.254: U1.44 41.58,24.65 R13.1
BOOT1  (via drill 0.51)
  Top 0.254: U1.20 52.19,26.15 v52.07,26.04 | R14.2 30.48,22.86 29.84,22.23 v29.84,21.59
  Bottom 0.254: v52.07,26.04 50.16,26.04 43.18,19.05 32.38,19.05 v29.84,21.59
CAN_RX
  Top 0.254: U6.4 36.83,18.41 37.47,19.05 39.88,19.05 42.42,21.59 42.42,22.99 43.58,24.15 U1.45
CAN_TX
  Top 0.254: U6.1 40.64,19.04 43,21.4 43,22.67 43.95,23.62 45.32,23.62 U1.46
CANH
  Top 0.254: U6.7 39.37,7.62 34.92,3.17 26.04,3.17 CAN.2 | R10.1 27.04,7.99 CAN.2 | CAN2.1 10.79,1.91 20.95,1.91 CAN.2
CANL  (via drill 0.51)
  Top 0.254: U6.6 38.1,10.79 34.92,7.62 31.75,7.62 | CAN_RES.2 31.75,12.06 31.75,7.62 | 31.75,7.62 CAN.3 | CAN2.2 14.61,3.17 20.32,3.17 24.77,7.62 v24.77,8.26
  Bottom 0.254: v24.77,8.26 26.04,8.26 CAN.3
ENC-A
  Top 0.254: ENCODER_INPUT.2 47.62,7.62 52.7,7.62 55.63,10.54 55.63,17.4 54.61,18.41 52.07,18.41 51.28,19.2 U1.10
ENC-B
  Top 0.254: ENCODER_INPUT.3 52.07,5.08 56.64,9.65 56.64,17.65 54.61,19.68 52.47,19.68 51.78,20.37 U1.11
ENC-Z
  Top 0.254: U1.14 53.74,23.12 54.59,23.12 57.78,19.92 57.78,7.62 ENCODER_INPUT.4
ENC_PWR
  Bottom 1.016: ENC_PWR_SELECT.2 16.51,12.06 16.51,3.81 17.78,2.54 37.47,2.54 ENCODER_INPUT.1
GND  (via drill 0.51, 1)
  other vias: 46.99,26.04 50.16,27.94 52.07,24.13 49.53,22.86 27.69,65.53 30.23,65.53 32.77,65.53 35.31,65.53 27.69,62.36 30.23,62.36 32.77,62.36 35.31,62.36 35.31,59.18 32.77,59.18 30.23,59.18 27.69,59.18 15.88,20.32 1.91,18.41 60.33,17.78 60.33,14.61 67.94,64.14 67.94,60.96 36.2,52.7 37.47,53.34
  pour Top (rank 4, no thermals): -1.27,-1.27 72.39,-1.27 72.39,72.39 -1.27,72.39
  pour Bottom (rank 4, no thermals): -2.54,-2.54 73.66,-2.54 73.66,73.66 -2.54,73.66
MOTOR_A1
  Top 2.032: STEPPER_OUTPUT.3 59.71,43.16 U2.12
MOTOR_A2
  Top 2.032: STEPPER_OUTPUT.2 66.55,40.64 U2.13
MOTOR_B1
  Top 2.032: STEPPER_OUTPUT.4 59.75,45.66 U2.11
MOTOR_B2
  Top 2.032: U2.14 59.75,38.16 STEPPER_OUTPUT.1
MOTOR_EN  (via drill 0.51)
  Top 0.254: v43.61,36.83 49.16,36.83 R7.2 53.71,35.83 v53.98,35.56 57.78,39.37 57.78,48.26 BTS_PINS.1 | U1.15 58.27,23.65 v58.42,23.5
  Bottom 0.254: v43.61,36.83 43.38,36.83 42.74,36.2 U5.8 40.01,36.2 39.37,36.83 39.37,40.64 40.01,41.27 U5.4 | v53.98,35.56 56.01,33.53 56.01,25.91 v58.42,23.5
MOTOR_PWM_M  (via drill 0.51)
  Top 0.254: v43.61,38.73 44.25,39.37 49.27,39.37 R8.2 51.17,37.47 v53.98,37.47 53.98,43.81 55.24,45.09 BTS_PINS.3 | v58.85,25.4 55.31,25.4 54.59,24.68 53.74,24.68 U1.17
  Bottom 0.254: U5.6 v43.61,38.73 | v58.85,25.4 57.1,27.15 57.1,34.34 v53.98,37.47
MOTOR_PWM_P  (via drill 0.51)
  Top 0.254: v43.61,43.81 44.25,44.45 49.27,44.45 R9.2 | U1.16 55.47,24.15 v55.88,24.56 | v52.7,38.73 52.7,42.55 51.7,43.55 R9.2 | R9.2 50.8,43.55 54.88,47.62 BTS_PINS.2
  Bottom 0.254: U5.2 v43.61,43.81 | v55.88,24.56 52.7,27.74 v52.7,38.73
MTR_A  (via drill 1)  (1 unrouted)
  other vias: 13.08,49.02 14.99,49.02 16.89,49.02 18.8,49.02 18.8,46.48 13.08,46.48 14.99,46.48 16.89,46.48 13.08,43.94 14.99,43.94 16.89,43.94 18.8,43.94 18.8,41.4 13.08,41.4 14.99,41.4 16.89,41.4
  pour Bottom (rank 2, no thermals): 3.81,40.01 20.32,40.01 20.32,50.16 11.43,50.16 11.43,44.45 3.81,44.45
  pour Top (rank 2, no thermals): 3.81,40.01 20.32,40.01 20.32,50.16 11.43,50.16 11.43,44.45 3.81,44.45
MTR_B  (via drill 1)  (1 unrouted)
  other vias: 13.08,37.59 14.99,37.59 16.89,37.59 18.8,37.59 18.8,35.05 13.08,35.05 14.99,35.05 16.89,35.05 13.08,32.51 14.99,32.51 16.89,32.51 18.8,32.51 18.8,29.97 13.08,29.97 14.99,29.97 16.89,29.97
  pour Top (rank 2, no thermals): 3.81,38.73 3.81,28.57 20.32,28.57 20.32,38.73
  pour Bottom (rank 2, no thermals): 3.81,38.73 3.81,28.57 20.32,28.57 20.32,38.73
N$1  (via drill 0.51, 1)
  other vias: 41.66,66.17 43.81,67.44 41.78,58.8 41.78,56.01 43.43,57.02 29.84,55.88
  pour Bottom (no thermals): 29.21,57.15 29.21,54.61 43.81,54.61 44.45,55.24 44.45,68.58 40.64,68.58 40.64,57.15
  pour Top (no thermals): 40.64,68.58 40.64,54.61 44.45,54.61 44.45,68.58
  pour Top (no thermals): 29.21,57.15 29.21,52.07 31.11,52.07 31.11,55.24 40.01,55.24 40.01,57.15
N$2
  Top 1.016: R2.2 R1.2 33.28,53.86 IC1.4
N$5
  Top 0.254: R10.2 28.84,12.44 CAN_RES.1
N$6
  Top 0.508: R6.2 30.21,34.92 U4.5
N$7
  Top 0.508: U4.6 27.94,36.2 28.57,36.83 R5.2
N$8
  Top 0.508: R4.2 30.21,47.62 U3.6
N$9
  Top 0.508: U3.5 R3.2
N$10
  Top 0.813: IC2.4 34.08,39.97 C8.2
N$12
  Top 0.254: R14.1 BOOT_JUMPERS.4
N$13
  Top 0.254: U6.8 42.59,12.01 R15.2
N$14
  Top 0.254: BOOT_JUMPERS.3 41.06,22.86 R13.2
OSCAOUT
  Top 0.254: U1.6 49.28,18.54 X1.2 51.31,13.31 C7.2
OSCIN
  Top 0.254: U1.5 48.78,18.81 X1.1 46.48,12.2 C6.2
RESET  (via drill 0.51)
  Top 0.254: U1.7 49.78,20.57 49.76,20.55 49.76,19.88 v50.44,19.2 | v46,10.31 47.51,10.31 C13.2 48.63,12.51 v47.9,13.24
  Top 0.508: S1.1 9.22,12.78 R11.2 23.86,12.96 v25.4,11.43
  Bottom 0.254: v25.4,11.43 26.67,10.16 45.85,10.16 v46,10.31 | v50.44,19.2 47.9,16.66 v47.9,13.24
RX1  (via drill 0.51)
  Top 0.254: U1.31 49.28,31.28 v49.65,31.65 | v57.78,36.83 54.81,33.86 v51.87,33.86
  Bottom 0.254: v51.87,33.86 51.86,33.86 v49.65,31.65 | RX1/TX1.3 65.45,31.11 64.97,31.6 64.29,31.6 61.59,34.29 59.05,34.29 58.27,35.08 58.27,35.76 57.78,36.24 v57.78,36.83
SCL
  Top 0.254: U1.21 59.08,26.65 62.41,23.32 62.41,8.08 64.01,6.48 65.3,6.48 66.04,7.22 66.04,9.02 | 66.04,9.02 AS5600.6 67.18,10.29 67.25,10.22 | 66.04,9.02 67.25,10.22 | 67.25,10.22 AS5600.5
SDA
  Top 0.254: U1.22 59.84,27.15 63.5,23.5 63.5,9.02 AS5600.4
  Bottom 0.254: AS5600.4 AS5600.3
STP_DIR
  Top 0.254: U2.1 42.55,33.02 41.27,31.75 41.27,26.8 41.92,26.15 U1.41
STP_EN  (via drill 0.51)
  Top 0.254: v42.11,31.11 41.91,30.91 41.91,27.3 42.56,26.65 U1.40
  Bottom 0.254: v42.11,31.11 44.45,33.45 44.45,48.26 U2.8
STP_MS1  (via drill 0.51)
  Top 0.254: v42.75,29.21 42.75,28.37 43.97,27.15 U1.39
  Bottom 0.254: U2.7 45.09,46.35 45.09,33.02 43.18,31.11 43.18,29.64 v42.75,29.21
STP_MS2  (via drill 0.51)
  Top 0.254: v44.02,30.48 44.02,28.14 44.5,27.65 U1.38
  Bottom 0.254: v44.02,30.48 45.72,32.18 45.72,44.45 U2.6
STP_PDN  (via drill 0.51)
  Top 0.254: U1.12 52.55,20.95 v55.24,20.95
  Bottom 0.254: U2.4 52.07,40.64 57.78,34.92 57.78,29.84 59.69,27.94 59.69,23.5 58.42,22.23 56.52,22.23 v55.24,20.95
STP_STEP
  Top 0.254: U1.42 41.66,25.65 40.64,26.67 40.64,32.38 43.81,35.56 U2.2
SWCLK  (via drill 0.51)
  Top 0.254: U1.37 45.09,28.41 45.09,31.11 45.72,31.75 46.99,31.75 47.12,31.88 47.94,31.88 49.08,33.02 52.96,33.02 55.5,30.48 59.1,30.48 59.61,29.97 61.47,29.97 v61.59,29.84
  Bottom 0.254: PROGRAMMING.3 61.59,26.42 v61.59,29.84
SWDIO
  Top 0.254: U1.34 47.78,30.96 49.35,32.54 52.54,32.54 55.69,29.39 60.78,29.39 65.09,25.08 65.09,20.38 PROGRAMMING.2
TX1  (via drill 0.51)
  Top 0.254: U1.30 49.78,30.59 50.88,31.7 52.19,31.7 v53.54,30.35 | v55.17,32.38 58.42,32.38 59.69,31.11 v60.33,31.11
  Bottom 0.254: v53.54,30.35 55.17,31.98 v55.17,32.38 | RX1/TX1.2 64.77,31.11 v60.33,31.11
VIN  (via drill 1, 1.7)
  Top 1.27: IC1.1 21.86,53.9
  Bottom 1.016: ENC_PWR_SELECT.1 10.79,25.4
  Bottom 2.54: U2.9 55.24,55.24 48.2,55.24 44.7,51.75 44.7,51.69 43.18,50.16 29.62,50.16 26.29,53.49 v23.22,53.49
  other vias: 22.23,44.45 22.23,41.91 22.1,48.01 22.43,49.89
  pour Top (no thermals): 2.54,50.8 25.4,50.8 25.4,60.96 2.54,60.96
  pour Bottom (rank 2, no thermals): 6.99,55.24 6.99,48.9 3.17,48.9 3.17,27.94 20.95,27.94 20.95,29.21 23.5,29.21 23.5,25.4 20.32,22.23 1.27,22.23 1.27,55.24
  pour Bottom (rank 2, no thermals): 23.5,29.21 23.5,48.26 27.3,48.26 27.3,55.88 20.95,55.88 20.95,29.21
  pour Top (rank 2, no thermals): 23.5,48.26 27.94,48.26 27.94,49.53 24.77,49.53 24.77,52.07 24.77,53.34 20.95,53.34 20.95,36.83 27.94,36.83 27.94,38.1 23.5,38.1

### Text on the board
tNames: VIN/GND | 3.3V/BOOT/GND
bNames: Swerve Drive AMR Board | Designed By:
tStop: Merthan KARAMAN | Egemen BAŞOL
bStop: Merthan KARAMAN | Egemen BAŞOL